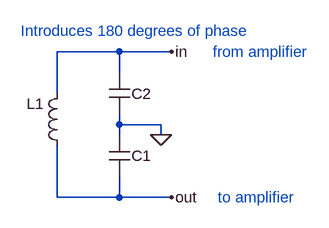
[diagram p0: schematic l_double_c_canonical.asc]
l_double_c_canonical.asc, the LTspice schematic file:
Version 4
SHEET 1 1104 680
WIRE 224 96 128 96
WIRE 304 96 224 96
WIRE 224 128 224 96
WIRE 128 160 128 96
WIRE 224 208 224 192
WIRE 288 208 224 208
WIRE 224 224 224 208
WIRE 288 224 288 208
WIRE 128 320 128 240
WIRE 224 320 224 288
WIRE 224 320 128 320
WIRE 304 320 224 320
FLAG 288 224 0
FLAG 304 96 in
FLAG 304 320 out
SYMBOL ind 144 256 R180
WINDOW 0 36 80 Left 2
WINDOW 3 36 40 Left 2
SYMATTR InstName L1
SYMATTR Value ""
SYMBOL cap 208 224 R0
WINDOW 0 35 32 Left 2
SYMATTR InstName C1
SYMATTR Value ""
SYMBOL cap 208 128 R0
WINDOW 0 35 33 Left 2
SYMATTR InstName C2
SYMATTR Value ""
TEXT 72 64 Left 2 ;Introduces 180 degrees of phase
TEXT 376 320 Left 2 ;to amplifier
TEXT 368 96 Left 2 ;from amplifier

The netlist it stands for:
* l_double_c_canonical.asc
L1 out in
C1 0 out
C2 in 0
* Introduces 180 degrees of phase
* to amplifier
* from amplifier
.backanno
.end